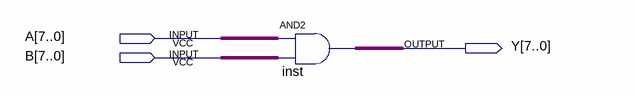
[diagram p0: schematic sheet]
// Quartus schematic AND2_8bit.bdf as structural Verilog: 1 symbols, 3 pins
module AND2_8bit (
  input  [7:0] A,
  input  [7:0] B,
  output [7:0] Y
);

  assign Y = A & B;  // AND2 inst, 8 bits wide
endmodule
